# Altium schematic sheet Overall Connections.SchDoc
size A3; SheetNumber: 1; SheetTotal: 12
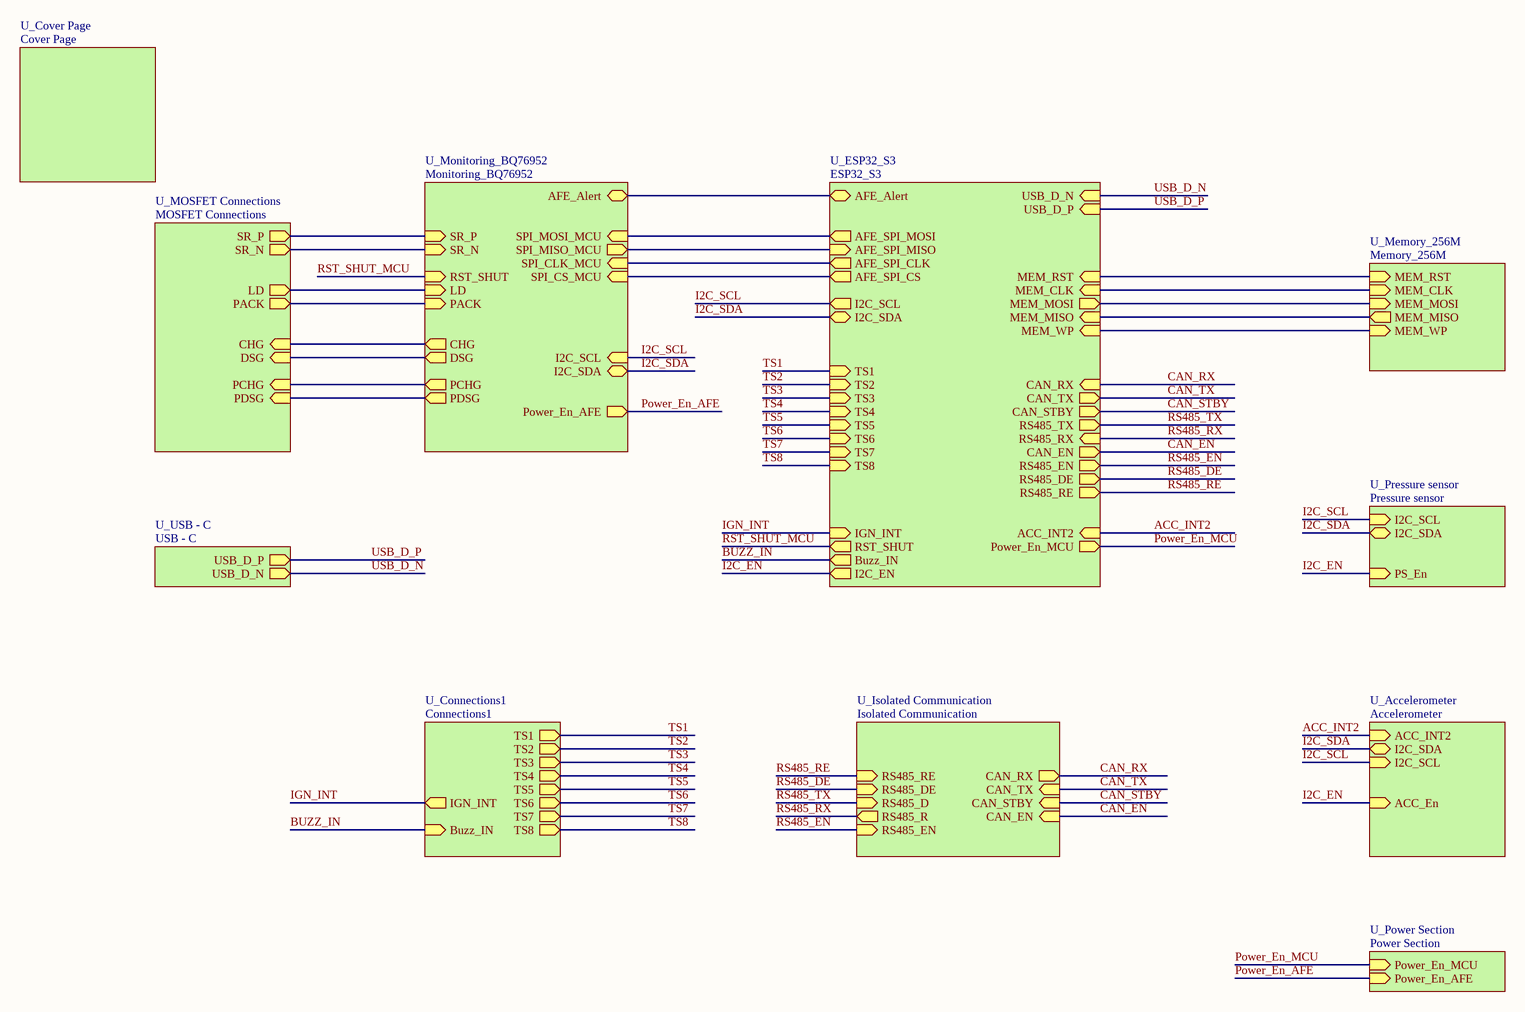
[diagram p0: Overall Connections.SchDoc]

## Sub-sheets
U_Accelerometer = Accelerometer: ACC_INT2 (in), I2C_SCL (in), ACC_En (in), I2C_SDA (bidir)
U_Connections1 = Connections1: TS1 (out), TS2 (out), TS3 (out), TS4 (out), TS5 (out), TS6 (out), TS7 (out), TS8 (out), Buzz_IN (in), IGN_INT (out)
U_Cover Page = Cover Page: no entries
U_ESP32_S3 = ESP32_S3: USB_D_P (in), USB_D_N (in), AFE_SPI_CS (out), AFE_SPI_MOSI (out), AFE_SPI_MISO (in), AFE_SPI_CLK (out), MEM_RST (in), MEM_MISO (in), MEM_CLK (in), MEM_WP (in), TS1 (in), TS2 (in), TS3 (in), TS4 (in), TS5 (in), TS6 (in), TS7 (in), TS8 (in), CAN_RX (in), CAN_TX (out), CAN_STBY (out), I2C_SCL (out), ACC_INT2 (in), Power_En_MCU (out), Buzz_IN (out), I2C_EN (out), MEM_MOSI (out), RST_SHUT (out), RS485_TX (out), RS485_RX (in), CAN_EN (out), RS485_EN (out), RS485_DE (out), RS485_RE (out), AFE_Alert (bidir), I2C_SDA (bidir), IGN_INT (in)
U_Isolated Communication = Isolated Communication: RS485_EN (in), RS485_RE (in), RS485_D (in), RS485_DE (in), RS485_R (out), CAN_TX (in), CAN_STBY (in), CAN_RX (out), CAN_EN (in)
U_Memory_256M = Memory_256M: MEM_RST (in), MEM_MISO (out), MEM_CLK (in), MEM_MOSI (in), MEM_WP (in)
U_Monitoring_BQ76952 = Monitoring_BQ76952: SR_P (in), SR_N (in), SPI_MOSI_MCU (in), AFE_Alert (bidir), SPI_MISO_MCU (out), SPI_CLK_MCU (in), RST_SHUT (in), CHG (out), DSG (out), SPI_CS_MCU (in), PDSG (out), PCHG (out), LD (in), PACK (in), Power_En_AFE (out), I2C_SCL (in), I2C_SDA (bidir)
U_MOSFET Connections = MOSFET Connections: SR_P (out), SR_N (out), LD (out), PACK (out), CHG (in), DSG (in), PCHG (in), PDSG (in)
U_Power Section = Power Section: Power_En_MCU (in), Power_En_AFE (in)
U_Pressure sensor = Pressure sensor: I2C_SCL (in), PS_En (in), I2C_SDA (bidir)
U_USB - C = USB - C: USB_D_P (out), USB_D_N (out)

## Nets
ACC_INT2: sheet U_ESP32_S3/ACC_INT2, sheet U_Accelerometer/ACC_INT2
BUZZ_IN: sheet U_ESP32_S3/Buzz_IN, sheet U_Connections1/Buzz_IN
CAN_EN: sheet U_ESP32_S3/CAN_EN, sheet U_Isolated Communication/CAN_EN
CAN_RX: sheet U_ESP32_S3/CAN_RX, sheet U_Isolated Communication/CAN_RX
CAN_STBY: sheet U_ESP32_S3/CAN_STBY, sheet U_Isolated Communication/CAN_STBY
CAN_TX: sheet U_ESP32_S3/CAN_TX, sheet U_Isolated Communication/CAN_TX
I2C_EN: sheet U_ESP32_S3/I2C_EN, sheet U_Accelerometer/ACC_En, sheet U_Pressure sensor/PS_En
I2C_SCL: sheet U_Monitoring_BQ76952/I2C_SCL, sheet U_ESP32_S3/I2C_SCL, sheet U_Accelerometer/I2C_SCL, sheet U_Pressure sensor/I2C_SCL
I2C_SDA: sheet U_Monitoring_BQ76952/I2C_SDA, sheet U_ESP32_S3/I2C_SDA, sheet U_Accelerometer/I2C_SDA, sheet U_Pressure sensor/I2C_SDA
IGN_INT: sheet U_ESP32_S3/IGN_INT, sheet U_Connections1/IGN_INT
Power_En_AFE: sheet U_Monitoring_BQ76952/Power_En_AFE, sheet U_Power Section/Power_En_AFE
Power_En_MCU: sheet U_ESP32_S3/Power_En_MCU, sheet U_Power Section/Power_En_MCU
RS485_DE: sheet U_ESP32_S3/RS485_DE, sheet U_Isolated Communication/RS485_DE
RS485_EN: sheet U_ESP32_S3/RS485_EN, sheet U_Isolated Communication/RS485_EN
RS485_RE: sheet U_ESP32_S3/RS485_RE, sheet U_Isolated Communication/RS485_RE
RS485_RX: sheet U_ESP32_S3/RS485_RX, sheet U_Isolated Communication/RS485_R
RS485_TX: sheet U_ESP32_S3/RS485_TX, sheet U_Isolated Communication/RS485_D
RST_SHUT_MCU: sheet U_Monitoring_BQ76952/RST_SHUT, sheet U_ESP32_S3/RST_SHUT
TS1: sheet U_ESP32_S3/TS1, sheet U_Connections1/TS1
TS2: sheet U_ESP32_S3/TS2, sheet U_Connections1/TS2
TS3: sheet U_ESP32_S3/TS3, sheet U_Connections1/TS3
TS4: sheet U_ESP32_S3/TS4, sheet U_Connections1/TS4
TS5: sheet U_ESP32_S3/TS5, sheet U_Connections1/TS5
TS6: sheet U_ESP32_S3/TS6, sheet U_Connections1/TS6
TS7: sheet U_ESP32_S3/TS7, sheet U_Connections1/TS7
TS8: sheet U_ESP32_S3/TS8, sheet U_Connections1/TS8
USB_D_N: sheet U_ESP32_S3/USB_D_N, sheet U_USB - C/USB_D_N
USB_D_P: sheet U_ESP32_S3/USB_D_P, sheet U_USB - C/USB_D_P
(unnamed): sheet U_Monitoring_BQ76952/SR_P, sheet U_MOSFET Connections/SR_P
(unnamed): sheet U_Monitoring_BQ76952/SR_N, sheet U_MOSFET Connections/SR_N
(unnamed): sheet U_Monitoring_BQ76952/SPI_MOSI_MCU, sheet U_ESP32_S3/AFE_SPI_MOSI
(unnamed): sheet U_Monitoring_BQ76952/AFE_Alert, sheet U_ESP32_S3/AFE_Alert
(unnamed): sheet U_Monitoring_BQ76952/SPI_MISO_MCU, sheet U_ESP32_S3/AFE_SPI_MISO
(unnamed): sheet U_Monitoring_BQ76952/SPI_CLK_MCU, sheet U_ESP32_S3/AFE_SPI_CLK
(unnamed): sheet U_Monitoring_BQ76952/CHG, sheet U_MOSFET Connections/CHG
(unnamed): sheet U_Monitoring_BQ76952/DSG, sheet U_MOSFET Connections/DSG
(unnamed): sheet U_Monitoring_BQ76952/SPI_CS_MCU, sheet U_ESP32_S3/AFE_SPI_CS
(unnamed): sheet U_Monitoring_BQ76952/PDSG, sheet U_MOSFET Connections/PDSG
(unnamed): sheet U_Monitoring_BQ76952/PCHG, sheet U_MOSFET Connections/PCHG
(unnamed): sheet U_Monitoring_BQ76952/LD, sheet U_MOSFET Connections/LD
(unnamed): sheet U_Monitoring_BQ76952/PACK, sheet U_MOSFET Connections/PACK
(unnamed): sheet U_ESP32_S3/MEM_RST, sheet U_Memory_256M/MEM_RST
(unnamed): sheet U_ESP32_S3/MEM_MISO, sheet U_Memory_256M/MEM_MISO
(unnamed): sheet U_ESP32_S3/MEM_CLK, sheet U_Memory_256M/MEM_CLK
(unnamed): sheet U_ESP32_S3/MEM_WP, sheet U_Memory_256M/MEM_WP
(unnamed): sheet U_ESP32_S3/MEM_MOSI, sheet U_Memory_256M/MEM_MOSI